# EAGLE schematic ESP8266-DS18B20-outside-lite (EAGLE 7.6.0)
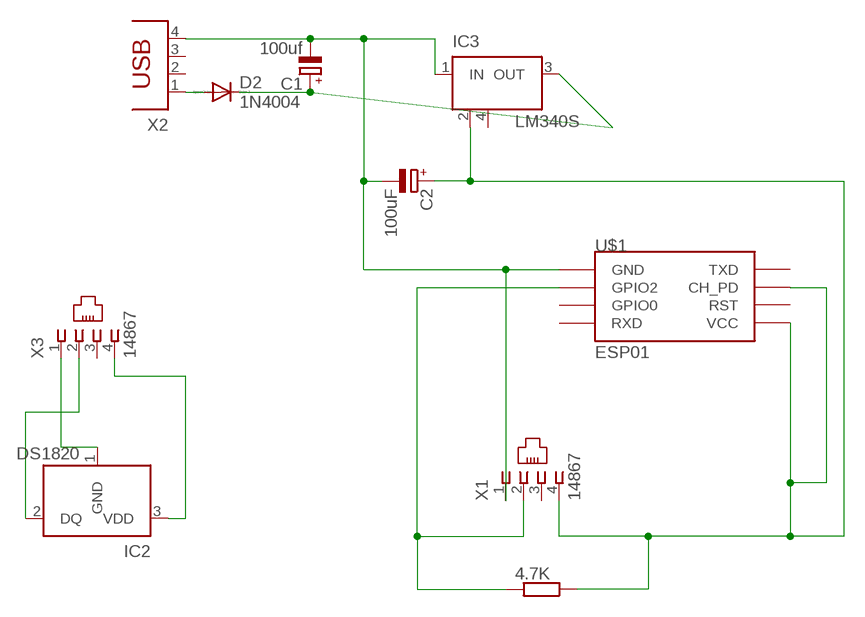
[diagram p0: schematic, sheet 1]

## Parts
4.7K  SMK  [SMK]
C1  100uf  CPOL-EUE2.5-5  [E2,5-5]
C2  100uF  CPOL-EUE2.5-5  [E2,5-5]
D2  1N4004  [DO41-10]
IC2  DS1820  [TO-92]
IC3  LM340S  [SOT223]
U$1  ESP01  [ESP01]
X1  14867  [14867]
X2  PN61729  [PN61729]
X3  14867  [14867]

## Nets
3V3: 4.7K.1 C2.+ IC3.2(GND) U$1.CH_PD U$1.VCC X1.4
5V: C1.+ D2.A D2.C IC3.3(OUT) X2.1
DQ: 4.7K.2 U$1.GPIO2 X1.2
GND: C1.- C2.- IC3.1(IN) U$1.GND X1.1 X2.4
P2_3V3: IC2.3(VDD) X3.4
P2_DQ: IC2.2(DQ) X3.2
P2_GND: IC2.1(GND) X3.1
Unconnected: U$1.GPIO0 U$1.RST U$1.RX(RXD) U$1.TX(TXD) X1.3 X2.2 X2.3 X3.3

## Power pins joined to a net without a drawn wire
GND: IC3.4(GND)

## Library data of the parts
4.7K = resistor-shunt:SMK: SMD SHUNT RESISTOR; OC_FARNELL: unknown; OC_NEWARK: unknown
C1 C2 = rcl:CPOL-EU: POLARIZED CAPACITOR, European symbol
D2 = diode:1N4004: DIODE general purpose rectifier, 1 A
IC2 = DS1820:DS1820: DS1820 - 1-Wire Digital Thermometer
IC3 = linear:LM340S: 3-Terminal Positive Regulators Source: http://cache.national.com/ds/LM/LM340.pdf
U$1 = esp8266modules:ESP01: ESP8266 Wifi module 01
X1 X3 = con-4ucon:14867: RJ11 Connector Source: 4UCON TECHNOLOGY INC. 14867.pdf; OC_FARNELL: unknown; OC_NEWARK: unknown
X2 = con-berg:PN61729: BERG USB connector; OC_FARNELL: unknown; OC_NEWARK: unknown